# Altium project testrack_breakout.PrjPcb
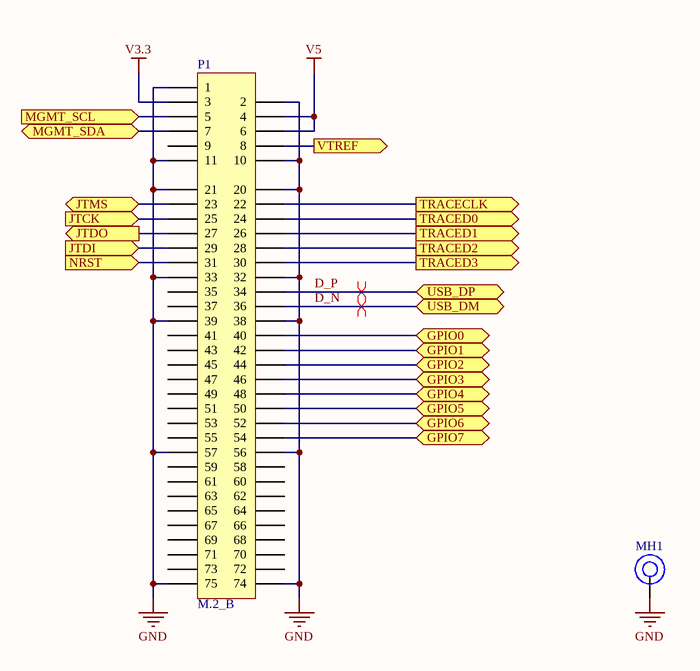
[diagram p0: target.SchDoc]
2 sheets, 12 parts. Net scope: flat (ports and power ports of the same name join across sheets).
Board file: testrack_breakout.PcbDoc
Sheets:
  target.SchDoc
  connectors.SchDoc

## Sheet target.SchDoc
size A

### Parts
MH1  Mounting_Hole  [WA-SMSI_M2.5]  (value not drawn)
P1  M.2_B  [M.2_B]

### Ports
GPIO0 (bidir), GPIO1 (bidir), GPIO2 (bidir), GPIO3 (bidir), GPIO4 (bidir), GPIO5 (bidir), GPIO6 (bidir), GPIO7 (bidir), JTCK (in), JTDI (in), JTDO (out), JTMS (bidir), MGMT_SCL (in), MGMT_SDA (bidir), NRST (in), TRACECLK (out), TRACED0 (out), TRACED1 (out), TRACED2 (out), TRACED3 (out), USB_DM (bidir), USB_DP (bidir), VTREF (out)

### Nets
GND: MH1.1 P1.1 P1.2 P1.10 P1.11 P1.20 P1.21 P1.32 P1.33 P1.38 P1.39 P1.56 P1.57 P1.74 P1.75
V3.3: P1.3
V5: P1.4 P1.6  [project net VTPWR]
D_N: P1.36 ; port USB_DM
D_P: P1.34 ; port USB_DP
GPIO0: P1.40 ; port GPIO0
GPIO1: P1.42 ; port GPIO1
GPIO2: P1.44 ; port GPIO2
GPIO3: P1.46 ; port GPIO3
GPIO4: P1.48 ; port GPIO4
GPIO5: P1.50 ; port GPIO5
GPIO6: P1.52 ; port GPIO6
GPIO7: P1.54 ; port GPIO7
JTCK: P1.25 ; port JTCK
JTDI: P1.29 ; port JTDI
JTDO: P1.27 ; port JTDO
JTMS: P1.23 ; port JTMS
NRST: P1.31 ; port NRST
SCL: P1.5 ; port MGMT_SCL
SDA: P1.7 ; port MGMT_SDA
TRACECLK: P1.22 ; port TRACECLK
TRACED0: P1.24 ; port TRACED0
TRACED1: P1.26 ; port TRACED1
TRACED2: P1.28 ; port TRACED2
TRACED3: P1.30 ; port TRACED3
VTREF: P1.8 ; port VTREF

Not connected (* = marked no-connect by the designer): P1 9 35 37 41 43 45 47 49 51 53 55 58 59 60 61 62 63 64 65 66 67 68 69 70 71 72 73

### Layout directives
differential pair: D_N, D_P

## Sheet connectors.SchDoc
size A
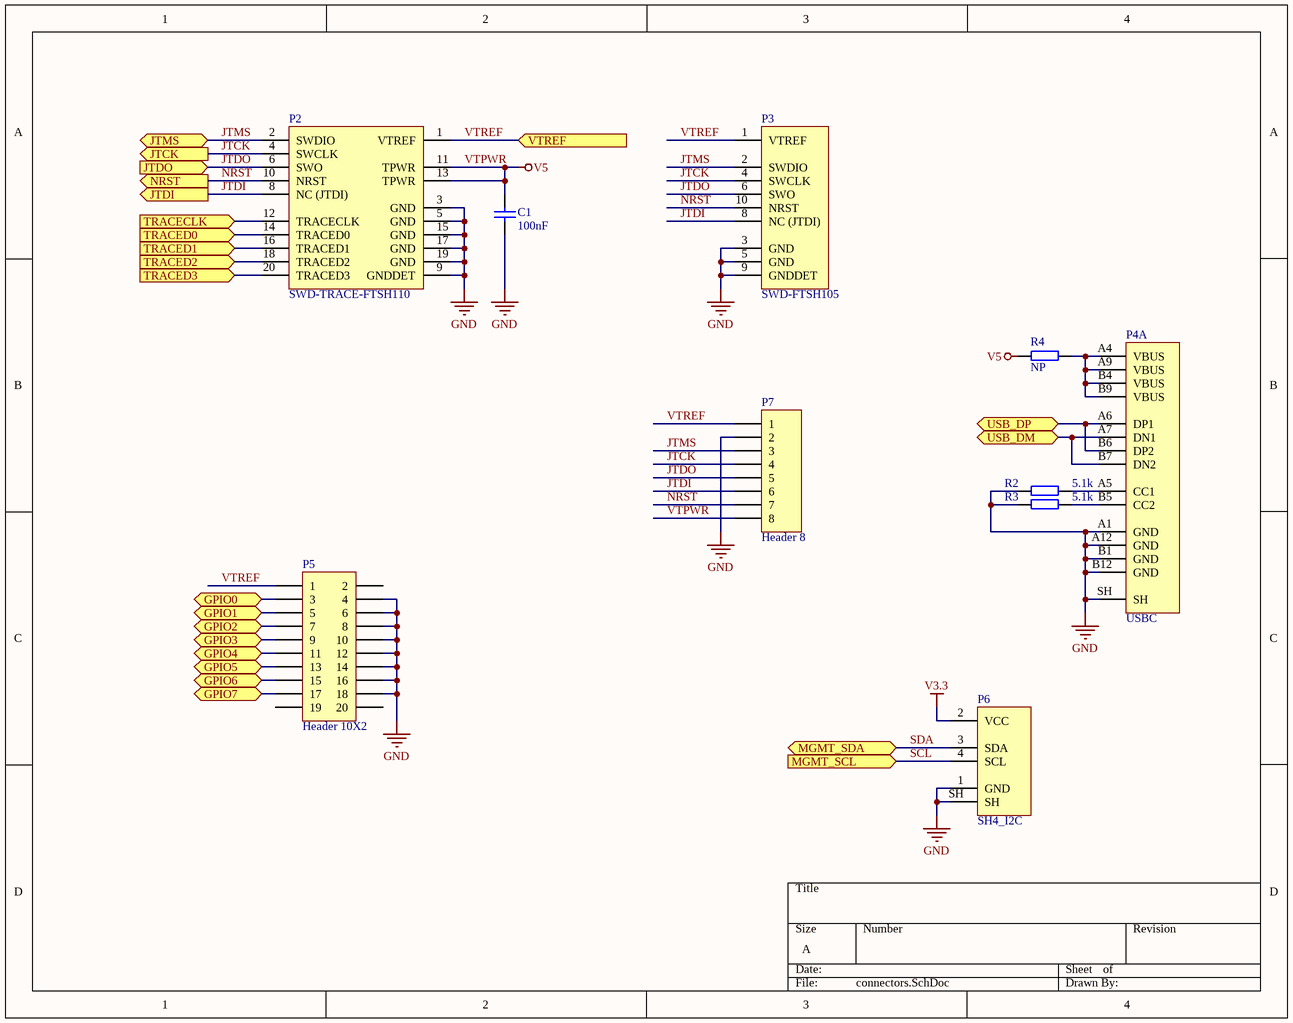
[diagram p1: connectors.SchDoc]

### Parts
C1  100nF  [0402]
P2  SWD-TRACE-FTSH110  [FTSH110]
P3  SWD-FTSH105  [FTSH105]
P4  USBC  [U262-161N-4BVC11]  (part A of 2)
P5  Header 10X2  [HDR2X10]
P6  SH4_I2C  [SM04B]
P7  Header 8  [HDR1X8]
R2  5.1k  [0402]
R3  5.1k  [0402]
R4  NP  [0402]

### Ports
GPIO0 (bidir), GPIO1 (bidir), GPIO2 (bidir), GPIO3 (bidir), GPIO4 (bidir), GPIO5 (bidir), GPIO6 (bidir), GPIO7 (bidir), JTCK (out), JTDI (out), JTDO (in), JTMS (bidir), MGMT_SCL (in), MGMT_SDA (bidir), NRST (out), TRACECLK (in), TRACED0 (in), TRACED1 (in), TRACED2 (in), TRACED3 (in), USB_DM, USB_DP, VTREF (in)

### Nets
GND: C1.1 P2.3(GND) P2.5(GND) P2.9(GNDDET) P2.15(GND) P2.17(GND) P2.19(GND) P3.3(GND) P3.5(GND) P3.9(GNDDET) P4.A1(GND) P4.A12(GND) P4.B1(GND) P4.B12(GND) P4.SH P5.4 P5.6 P5.8 P5.10 P5.12 P5.14 P5.16 P5.18 P6.1(GND) P6.SH P7.2 R2.1 R3.1
V3.3: P6.2(VCC)
VTPWR: C1.2 P2.11(TPWR) P2.13(TPWR) P7.8 R4.1  [also labelled V5]
D_N: P4.A7(DN1) P4.B7(DN2) ; port USB_DM
D_P: P4.A6(DP1) P4.B6(DP2) ; port USB_DP
GPIO0: P5.3 ; port GPIO0
GPIO1: P5.5 ; port GPIO1
GPIO2: P5.7 ; port GPIO2
GPIO3: P5.9 ; port GPIO3
GPIO4: P5.11 ; port GPIO4
GPIO5: P5.13 ; port GPIO5
GPIO6: P5.15 ; port GPIO6
GPIO7: P5.17 ; port GPIO7
JTCK: P2.4(SWCLK) P3.4(SWCLK) P7.4 ; port JTCK
JTDI: P2.8(NC_(JTDI)) P3.8(NC_(JTDI)) P7.6 ; port JTDI
JTDO: P2.6(SWO) P3.6(SWO) P7.5 ; port JTDO
JTMS: P2.2(SWDIO) P3.2(SWDIO) P7.3 ; port JTMS
NRST: P2.10(NRST) P3.10(NRST) P7.7 ; port NRST
SCL: P6.4(SCL) ; port MGMT_SCL
SDA: P6.3(SDA) ; port MGMT_SDA
TRACECLK: P2.12(TRACECLK) ; port TRACECLK
TRACED0: P2.14(TRACED0) ; port TRACED0
TRACED1: P2.16(TRACED1) ; port TRACED1
TRACED2: P2.18(TRACED2) ; port TRACED2
TRACED3: P2.20(TRACED3) ; port TRACED3
VTREF: P2.1(VTREF) P3.1(VTREF) P5.1 P7.1 ; port VTREF
NetP4_A4: P4.A4(VBUS) P4.A9(VBUS) P4.B4(VBUS) P4.B9(VBUS) R4.2
NetP4_A5: P4.A5(CC1) R2.2
NetP4_B5: P4.B5(CC2) R3.2

Not connected (* = marked no-connect by the designer): P5 2 19 20

### Library data of the parts
C1 = Capacitor: Value: 100nF
P4 = USBC: pin to pad: A2>none A3>none A10>none A11>none B2>none B3>none B10>none B11>none
P5 = Header 10X2: Header, 10-Pin, Dual row; LatestRevisionDate: 17-Jul-2002; LatestRevisionNote: Re-released for DXP Platform.; Publisher: Altium Limited
P6 = SH4_I2C: Qwiic / STEMMA QT Compatible
P7 = Header 8: Header, 8-Pin; LatestRevisionDate: 17-Jul-2002; LatestRevisionNote: Re-released for DXP Platform.; Publisher: Altium Limited
R2-R4 = Resistor
  R2 R3: Value: 5.1k
  R4: Value: NP

## Nets that join several sheets
GND: target (15 pins), connectors (28 pins)
V3.3: target (P1.3), connectors (P6.2)
VTPWR: target (P1.4 P1.6), connectors (5 pins)
D_N: target (P1.36), connectors (P4.A7 P4.B7)
D_P: target (P1.34), connectors (P4.A6 P4.B6)
GPIO0: target (P1.40), connectors (P5.3)
GPIO1: target (P1.42), connectors (P5.5)
GPIO2: target (P1.44), connectors (P5.7)
GPIO3: target (P1.46), connectors (P5.9)
GPIO4: target (P1.48), connectors (P5.11)
GPIO5: target (P1.50), connectors (P5.13)
GPIO6: target (P1.52), connectors (P5.15)
GPIO7: target (P1.54), connectors (P5.17)
JTCK: target (P1.25), connectors (P2.4 P3.4 P7.4)
JTDI: target (P1.29), connectors (P2.8 P3.8 P7.6)
JTDO: target (P1.27), connectors (P2.6 P3.6 P7.5)
JTMS: target (P1.23), connectors (P2.2 P3.2 P7.3)
NRST: target (P1.31), connectors (P2.10 P3.10 P7.7)
SCL: target (P1.5), connectors (P6.4)
SDA: target (P1.7), connectors (P6.3)
TRACECLK: target (P1.22), connectors (P2.12)
TRACED0: target (P1.24), connectors (P2.14)
TRACED1: target (P1.26), connectors (P2.16)
TRACED2: target (P1.28), connectors (P2.18)
TRACED3: target (P1.30), connectors (P2.20)
VTREF: target (P1.8), connectors (P2.1 P3.1 P5.1 P7.1)